# EAGLE design NixiePower (EAGLE 9.6.2)
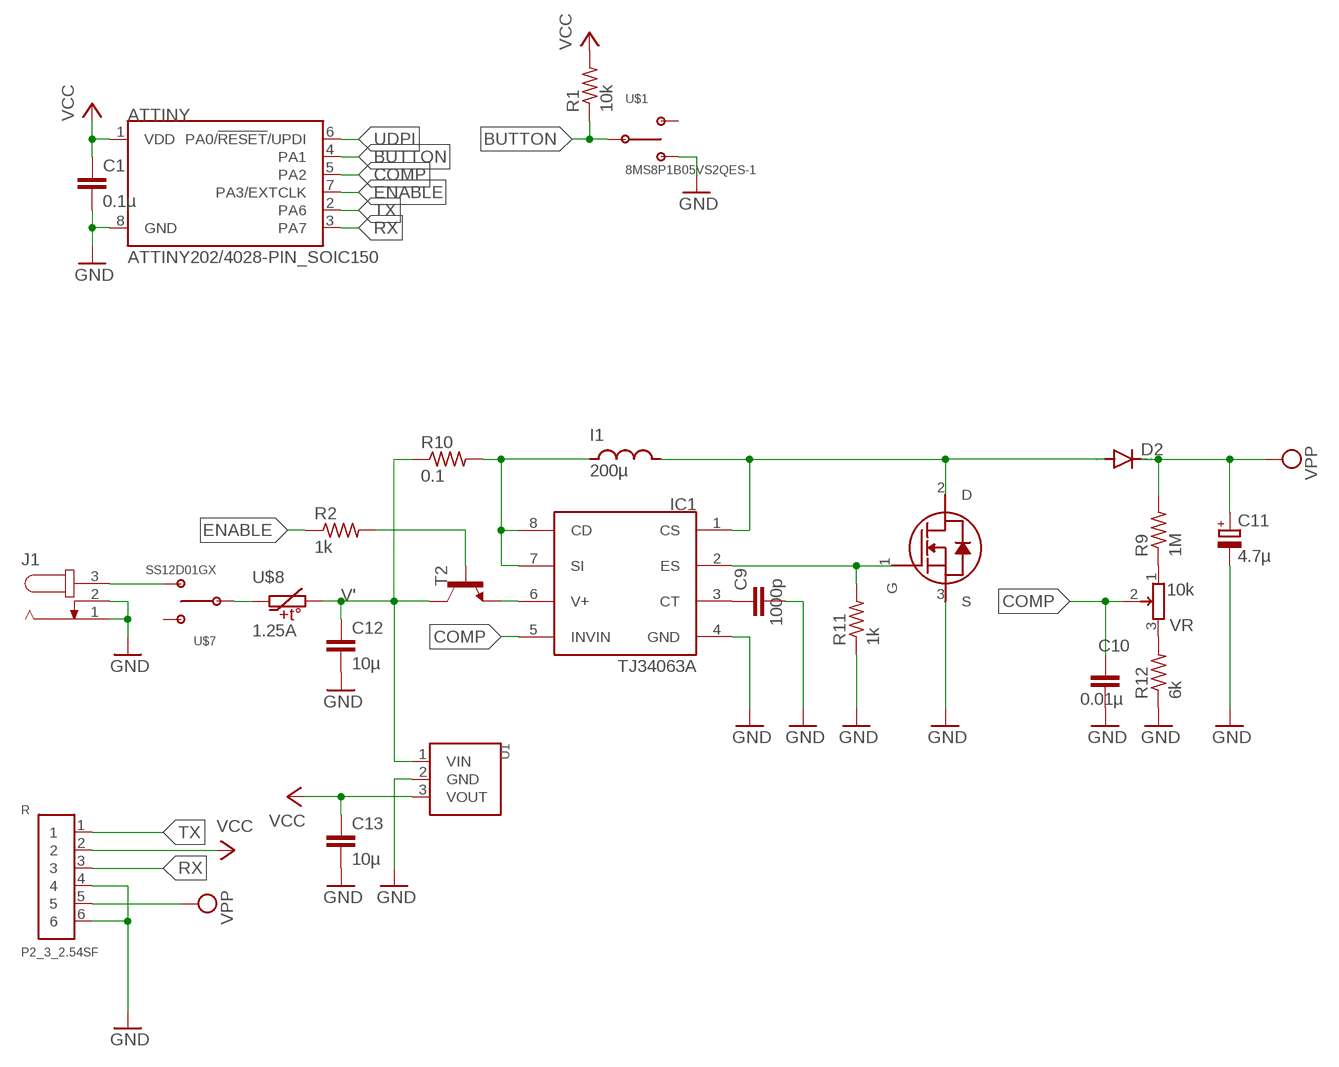
[diagram p0: schematic, sheet 1]

## Parts
ATTINY  ATTINY202/4028-PIN_SOIC150  [SOIC127P600X175-8N]
C1  0.1µ  C-EUC0603  [C0603]
C9  1000p  C-EUC0603  [C0603]
C10  0.01µ  C-EUC0603  [C0603]
C11  4.7µ  CPOL-EUE5-10.5  [E5-10,5]
C12  10µ  C-EUC0603  [C0603]
C13  10µ  C-EUC0603  [C0603]
D2  DIODE-DO15-12  [DO15-12]
I1  200µ  NR10050  [NR10050]
IC1  TJ34063A  [SOP8]
J1  JACK-PLUG1  [SPC4078]
R  P2_3_2.54SF  [P2_3_2.54SF]
R1  10k  R-US_R0603  [R0603]
R2  1k  R-US_R0603  [R0603]
R9  1M  R-US_R0603  [R0603]
R10  0.1  R-US_R0603  [R0603]
R11  1k  R-US_R0603  [R0603]
R12  6k  R-US_R0603  [R0603]
T1  R6006AND  [CPT3]
T2  -NPN-SOT23-EBC  [SOT23-EBC]
U1  VX078XX-500  [VX078XX-500]
U$1  8MS8P1B05VS2QES-1  [8MS8P1B05VS2QES-1]
U$7  SS12D01GX  [SS12D01GX]
U$8  1.25A  SMD1812P125TS  [SMD1812P]
VR  10k  RK09D  [RK09D]

## Nets
BUTTON: ATTINY.4(PA1) R1.1 U$1.2(C)
COMP: ATTINY.5(PA2) C10.1 IC1.5(INVIN) VR.2
ENABLE: ATTINY.7(PA3/EXTCLK) R2.1
GND: ATTINY.8(GND) C1.2 C9.2 C10.2 C11.- C12.2 C13.2 IC1.4(GND) J1.1 J1.2 R11.1 R12.1 R.4 R.6 T1.3(S) U1.2(GND) U$1.3(B)
N$1: IC1.6(V+) T2.E
N$2: R2.2 T2.B
N$3: U$7.2(C) U$8.1
N$4: J1.3 U$7.3(B)
N$11: D2.A I1.2 IC1.1(CS) T1.2(D)
N$14: C9.1 IC1.3(CT)
N$15: I1.1 IC1.7(SI) IC1.8(CD) R10.2
N$18: IC1.2(ES) R11.2 T1.1(G)
N$20: R9.1 VR.1
N$21: R12.2 VR.3
RX: ATTINY.3(PA7) R.3
TX: ATTINY.2(PA6) R.1
UDPI: ATTINY.6(PA0/!RESET!/UPDI)
V': C12.1 R10.1 T2.C U1.1(VIN) U$8.2
VCC: ATTINY.1(VDD) C1.1 C13.1 R1.2 R.2 U1.3(VOUT)
VPP: C11.+ D2.C R9.2 R.5
Unconnected: U$1.1(A) U$7.1(A)

## Library data of the parts
ATTINY = microcontrollers:ATTINY202/402
C1 C10 C12 C13 = rcl:C-EU: CAPACITOR, European symbol; SPICEPREFIX: C
C9 = resistor:C-EU: CAPACITOR, European symbol
C11 = rcl:CPOL-EU: POLARIZED CAPACITOR, European symbol; SPICEPREFIX: C
D2 = diode:DIODE-: DIODE
I1 = inductors:NR10050
IC1 = dcdc:TJ34063A
J1 = con-jack:JACK-PLUG: DC POWER JACK Power Jack, DC, Right Angle, Through Hole, Rated 5A at 16VDC, PC Terminals Distributor: Farnell (www.Farnell.de) Drawing: 84N1161.pdf / 84N1162.pdf Manufacturer: SPC Technology (www.spctechnology.com) Type: SPC4077 / SPC 4078; OC_FARNELL: unknown; OC_NEWARK: unknown
R = pins:P2_3_2.54SF
R1 R2 R9-R12 = rcl:R-US_: RESISTOR, American symbol; SPICEPREFIX: R
T1 = mosfets:R6006AND
T2 = transistor:*-NPN-: NPN Transistror BF959 corrected 2008.03.06
U1 = dcdc:VX078XX-500
U$1 = switches:8MS8P1B05VS2QES-1
U$7 = switches:SS12D01GX
U$8 = ptc:SMD1812P125TS
VR = potentiometers:RK09D

## Board
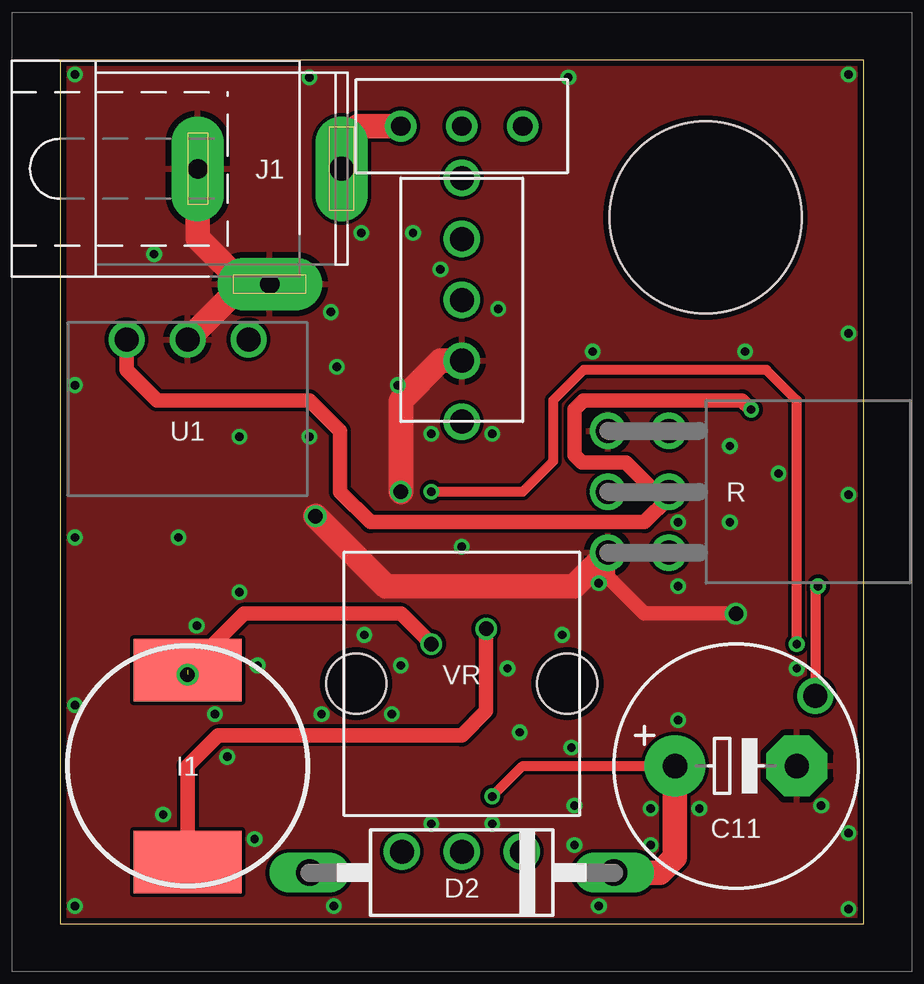
[diagram p1: board, top side]
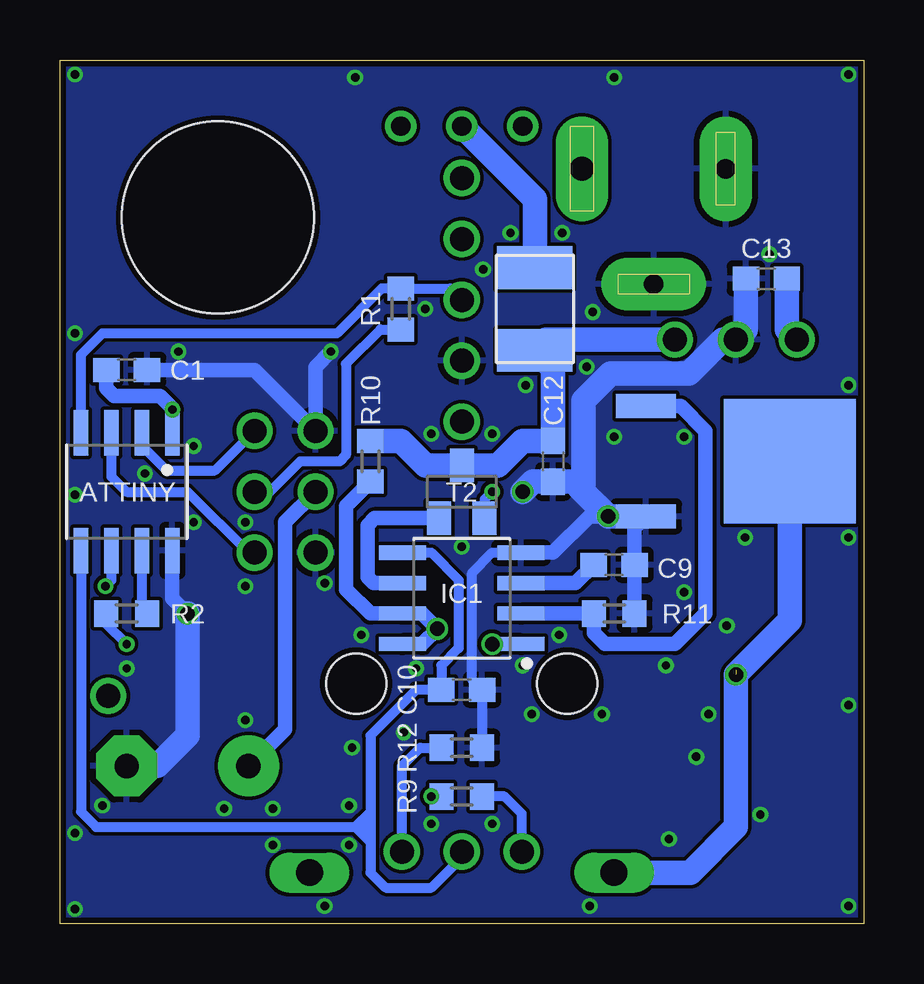
[diagram p2: board, bottom side, seen from below]

Size 33.5 x 36 mm. Coordinates in mm from the lower left corner, seen from the top.
Outline: 0,0 33.5,0 33.5,36 0,36 0,0
Copper layers (1*16): Top 0.035mm / dielectric 1.5mm / Bottom 0.035mm
Design rules "SeeedStudio_2layer_DRU_no_angle_20140221": minimum track width 6mil, minimum drill 12mil, track to track 6mil, track to pad 6mil, pad to pad 6mil, via to via 6mil, smd to smd 0mil, copper to edge 10mil, drill to drill 10mil, minimum pad ring 10mil, minimum via ring 6mil, stop-mask expansion 2mil, vias tented up to drill 100mil, thermal gap 10mil
Holes 8 mm at 26.91,29.43

### Footprints (pad centres in the part's own frame; a part is rotated, then mirrored left to right if it is on the bottom)
SOIC127P600X175-8N = smd 1.901 x 0.599: 1 -2.455,1.905; 2 -2.455,0.635; 3 -2.455,-0.635; 4 -2.455,-1.905; 5 2.455,-1.905; 6 2.455,-0.635; 7 2.455,0.635; 8 2.455,1.905
C0603 = smd 1.1 x 1: 1 -0.85,0; 2 0.85,0
E5-10,5 = drill 1.016 pad 2.54: + -2.54,0 | drill 1.016 pad 2.54 octagon: - 2.54,0
DO15-12 = drill 1.118 long: A 6.35,0; C -6.35,0
NR10050 = smd 2.6 x 4.5: 1 -4,0; 2 4,0
SOP8 = smd 1.968 x 0.589: 1 -2.473,1.905; 2 -2.473,0.635; 3 -2.473,-0.635; 4 -2.473,-1.905; 5 2.473,-1.905; 6 2.473,-0.635; 7 2.473,0.635; 8 2.473,1.905
SPC4078 = drill 0.8 pad 2.184 long: 1 -3,0; 2 0,-4.8 | drill 1 pad 2.184 long: 3 3,0
P2_3_2.54SF = drill 1: 1 2.54,2.54; 2 2.54,0; 3 2.54,-2.54; 4 0,2.54; 5 0,0; 6 0,-2.54
R0603 = smd 1 x 1.1: 1 -0.85,0; 2 0.85,0
CPT3 = smd 2.5 x 1: 1 3.75,-2.3; 3 3.75,2.3 | smd 5.5 x 5.2: 2 -2.25,0
SOT23-EBC = smd 1 x 1.4: B 0.95,-1.1; C 0,1.1; E -0.95,-1.1
VX078XX-500 = drill 1: 1 -2.54,0; 2 0,0; 3 2.54,0
8MS8P1B05VS2QES-1 = drill 1: 1 0,2.54; 2 0,0; 3 0,-2.54; G1 0,5.08; G2 0,-5.08
SS12D01GX = drill 0.8: 1 -2.54,0; 2 0,0; 3 2.54,0
SMD1812P = smd 1.78 x 3.15: 1 -1.725,0; 2 1.725,0
RK09D = drill 1: 1 -2.5,-7; 2 0,-7; 3 2.5,-7 | hole 2.5: -4.4,0; 4.4,0

### Placement (x,y rotation side)
ATTINY  30.72,18 270 bottom
C1  30.72,23.08 0 bottom
C9  10.4,14.95 0 bottom
C10  16.75,9.74 0 bottom
C11  28.18,6.57 0 top
C12  12.94,19.27 270 bottom
C13  4.05,26.89 180 bottom
D2  16.75,2.12 180 top
I1  5.32,6.57 90 top
IC1  16.75,13.55 180 bottom
J1  8.75,31.46 0 top
R  22.85,18 0 top
R1  19.29,25.62 270 bottom
R2  30.72,12.92 180 bottom
R9  16.75,5.3 180 bottom
R10  20.56,19.27 270 bottom
R11  10.4,12.92 180 bottom
R12  16.75,7.33 180 bottom
T1  5.32,19.27 180 bottom
T2  16.75,18 0 bottom
U1  5.32,24.35 180 top
U$1  16.75,26 0 top
U$7  16.75,33.24 180 top
U$8  13.7,25.62 270 bottom
VR  16.75,10 0 top

### Tracks (layer width: path | path; a pad name or v marks a point on that pad's centre or on a via)
BUTTON
  Bottom 0.406: ATTINY.4 32.62,23.71 31.74,24.6 21.96,24.6 20.09,26.47 R1.1 17.22,26.47 U$1.2
COMP
  Bottom 0.406: IC1.5 18.02,15.46 16.88,14.32 16.88,11.48 17.6,10.76 C10.1 18.66,9.74 20.56,7.84 20.56,4.66 | VR.2 16.75,2.76 18.02,1.49 19.93,1.49 20.56,2.12 20.56,3.39 | 20.56,4.66 20.56,4.03 | 20.56,4.03 20.56,3.39 | ATTINY.5 32.62,4.66 31.99,4.03 21.83,4.03 21.2,4.03 | 21.2,4.03 20.56,4.03 | 20.56,4.66 21.2,4.03 | 21.2,4.03 20.56,3.39
ENABLE
  Bottom 0.406: ATTINY.7 30.09,13.13 R2.1
GND  (via drill 0.35, 0.6)
  Top 0.61: v28.18,12.92 24.37,12.92 22.85,14.44 R.6
  Top 1.016: J1.2 7.66,26.66 | 7.66,26.66 5.75,28.57 J1.1 | U1.2 7.63,26.66 7.66,26.66 | v14.21,18 14.21,21.81 15.86,23.46 U$1.3 | v10.65,16.98 13.59,14.05 21.43,14.05 R.6
  Bottom 0.406: R12.1 C10.2 16.32,10.16 16.32,14.62 15.48,15.46 IC1.4
  Bottom 0.61: R11.1 C9.2 9.55,16.49 T1.3 | IC1.4 12.94,15.46 11.43,16.97 v10.64,16.97 | ATTINY.8 28.81,13.55 v28.18,12.92 | v22.21,23.84 22.85,23.21 R.4 25.39,23.08 C1.2
  Bottom 1.016: 11.67,18 v10.65,16.98 v10.64,16.97 T1.3 | 11.67,18 11.67,21.81 10.54,22.94 7.27,22.94 5.86,24.35 U1.2 4.9,24.77 C13.2 | 11.67,18 12.09,18.42 C12.2 13.79,18.42 v14.21,18 | v28.18,12.92 28.18,7.84 29.45,6.57 C11.-
  other vias: 14.08,22.45 0.62,35.4 10.4,35.27 21.2,35.27 32.88,35.4 32.88,24.6 28.56,23.84 18.27,25.62 15.86,27.27 14.72,28.8 12.56,28.8 11.29,25.49 11.54,23.21 3.92,27.91 0.62,22.45 7.48,20.29 10.4,20.29 4.94,16.09 0.62,16.09 7.48,13.81 5.7,12.41 0.62,9.11 6.46,8.73 8.24,10.76 6.97,6.95 4.3,4.54 0.62,0.73 8.11,3.52 11.42,0.73 12.69,12.03 14.21,10.76 13.83,8.73 10.91,8.73 15.48,4.16 18.02,4.16 18.02,20.41 15.48,20.41 16.75,15.71 25.77,16.73 27.93,19.91 29.96,18.76 27.93,16.73 32.88,17.87 30.72,10.63 32.88,3.78 31.74,4.92 32.88,0.6 26.66,4.79 24.62,4.79 24.62,3.27 21.45,3.27 21.45,4.92 21.32,7.33 19.16,7.97 20.94,12.03 18.66,10.63 22.46,0.73 25.77,14.06 22.46,14.19 25.77,8.47
  pour Top: -1.03,37.05 34.53,37.05 34.53,-1.05 -1.03,-1.05 -1.03,35.78
  pour Bottom: -2.3,38.32 35.8,38.32 35.8,-2.32 -2.3,-2.32
N$1
  Bottom 0.61: T2.E 20.39,16.9 20.69,16.6 20.69,14.44 20.43,14.19 IC1.6
N$2  (via drill 0.35)
  Top 0.406: v30.72,11.65 30.72,21.81 29.45,23.08 21.83,23.08 20.56,21.81 20.56,19.27 19.29,18 v15.48,18
  Bottom 0.406: R2.2 31.57,12.5 v30.72,11.65 | v15.48,18 15.8,17.68 T2.B
N$3
  Bottom 1.016: U$7.2 13.7,30.19 U$8.1
N$4
  Top 1.016: U$7.3 12.43,33.24 11.75,32.55 J1.3
N$11  (via drill 0.6)  (1 unrouted)
  Top 0.61: v15.48,11.65 14.21,12.92 7.67,12.92 I1.2
  Bottom 0.61: IC1.1 v15.48,11.65
  Bottom 1.016: T1.2 3.07,12.63 v5.32,10.38 5.32,4.03 7.22,2.12 D2.A
N$14
  Bottom 0.61: IC1.3 12.01,14.19 C9.1
N$15  (via drill 0.6)
  Top 0.61: v17.77,12.29 17.77,8.86 16.75,7.84 6.59,7.84 5.32,6.57 I1.1
  Bottom 0.61: R10.2 21.58,17.4 21.58,13.94 20.56,12.92 IC1.7 18.4,12.92 v17.77,12.29 18.4,11.65 IC1.8
N$18
  Bottom 0.61: IC1.2 R11.2 11.25,12.12 10.78,11.65 7.86,11.65 6.59,12.92 6.59,20.54 7.62,21.57 T1.1
N$20
  Bottom 0.406: VR.1 14.25,4.58 14.97,5.3 R9.1
N$21
  Bottom 0.406: VR.3 19.25,6.57 18.49,7.33 R12.2
RX
  Bottom 0.406: ATTINY.3 31.36,18.64 30.72,18 28.18,18 25.64,15.46 R.3
TX
  Bottom 0.406: ATTINY.2 30.09,19.93 29.04,18.89 27.04,18.89 R.1
UDPI  (via drill 0.35, 1)
  Top 0.406: v31.61,14.06 31.48,13.94 v31.48,9.49
  Bottom 0.406: v31.61,14.06 31.36,14.32 ATTINY.6
V'
  Bottom 1.016: U1.1 13.25,24.35 U$8.2 | U$8.2 13.79,23.81 | U$8.2 12.94,23.13 C12.1 14.21,20.12 15.23,19.1 T2.C 18.27,19.1 19.29,20.12 R10.1
VCC  (via drill 0.35)
  Top 0.61: v28.81,21.43 28.43,21.81 21.83,21.81 21.45,21.43 21.45,19.52 21.76,19.21 23.6,19.21 24.81,18 R.2 25.39,17.75 24.37,16.73 12.94,16.73 11.67,18 11.67,20.54 10.4,21.81 4.05,21.81 2.78,23.08 U1.3
  Bottom 0.406: R1.2 20.14,24.77 21.58,23.33 21.58,19.52 21.83,19.27 23.48,19.27 24.75,18 R.2
  Bottom 0.61: C1.1 31.57,22.32 31.24,21.99 29.32,21.99 28.81,21.49 v28.81,21.43 ATTINY.1
  Bottom 1.016: C13.1 3.2,24.77 U1.3
VPP  (via drill 0.35)
  Top 0.406: v18.02,5.3 19.29,6.57 C11.+
  Top 1.016: D2.C 25.01,2.12 25.64,2.76 C11.+
  Bottom 0.406: R9.2 v18.02,5.3
  Bottom 0.61: R.5 24.12,16.73 24.12,8.09 C11.+

### Text on the board
bStop: Designed by @fujiy0, 2020